# Altium schematic sheet memory.SchDoc
size A4
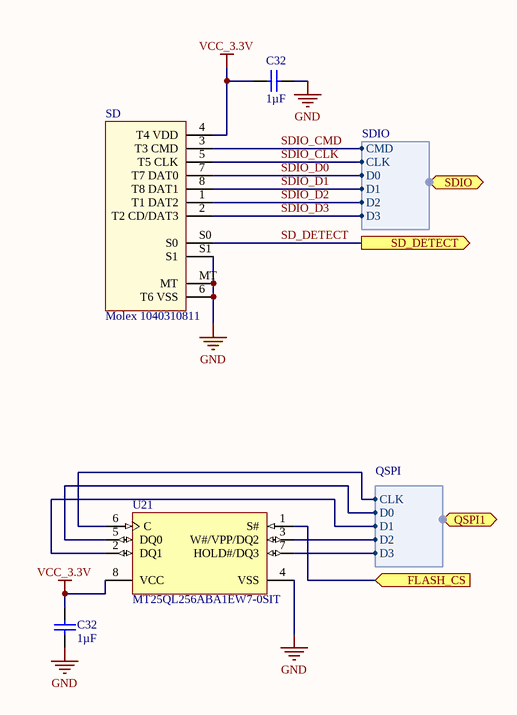
[diagram p0: memory.SchDoc]

## Parts
(Parts that share a designator on the sheet are numbered #1, #2 ... from top to bottom, then left to right.)
C32#1  1µF  [CAPC1608X90X35LL15T15]
C32#2  1µF  [CAPC1608X90X35LL15T15]
SD  Molex 1040310811  [PCB-e07cv7eyfg1wxdj7ioop-1]
U21  MT25QL256ABA1EW7-0SIT  [Micron W7 PDFN-8 MLP-8]

## Ports
FLASH_CS (in), QSPI1 (harness QSPI), SD_DETECT (out), SDIO (harness SDIO)

## Harnesses
SDIO: CLK, CMD, D0, D1, D2, D3
QSPI: CLK, D0, D1, D2, D3

## Nets
GND: C32#1.2 C32#2.1 SD.6(T6_VSS) SD.MT SD.S1 U21.4(VSS)
VCC_3.3V: C32#1.1 C32#2.2 SD.4(T4_VDD) U21.8(VCC)
FLASH_CS: U21.1(S#) ; port FLASH_CS
SD_DETECT: SD.S0 ; port SD_DETECT
SDIO_CLK: SD.5(T5_CLK) ; port SDIO.CLK
SDIO_CMD: SD.3(T3_CMD) ; port SDIO.CMD
SDIO_D0: SD.7(T7_DAT0) ; port SDIO.D0
SDIO_D1: SD.8(T8_DAT1) ; port SDIO.D1
SDIO_D2: SD.1(T1_DAT2) ; port SDIO.D2
SDIO_D3: SD.2(T2_CD/DAT3) ; port SDIO.D3
NetU21_2: U21.2(DQ1) ; port QSPI1.D1
NetU21_3: U21.3(W#/VPP/DQ2) ; port QSPI1.D2
NetU21_5: U21.5(DQ0) ; port QSPI1.D0
NetU21_6: U21.6(C) ; port QSPI1.CLK
NetU21_7: U21.7(HOLD#/DQ3) ; port QSPI1.D3

## Library data of the parts
C32#1 C32#2 = CMP-f2f83b8d074c2d3f-6: 0603 1 uF 16 V ±10 % Tolerance X5R SMT Multilayer Ceramic Capacitor; Capacitance Tolerance: ±10%; Lead-Free Status: Lead Free; Voltage Rating (DC): 16.0 V; Dielectric Characteristic: X5R; Mounting Style: Surface Mount; OctopartID: f2f83b8d074c2d3f
SD = CMP-a4a36cb6bd117b64-5: 1.10mm Pitch microSD Memory Card Connector, SMT, Push-Pull Type, 1.42mm Height, with Detect Switch
U21 = CMP-fb1530fa0f9224d2-1: NOR Flash Serial-SPI 3.3V 256Mbit 256M x 1bit 8-Pin WPDFN; Manufacturer Part Number: MT25QL256ABA1EW7-0SIT